# Altium project BMS_Master.PrjPcb
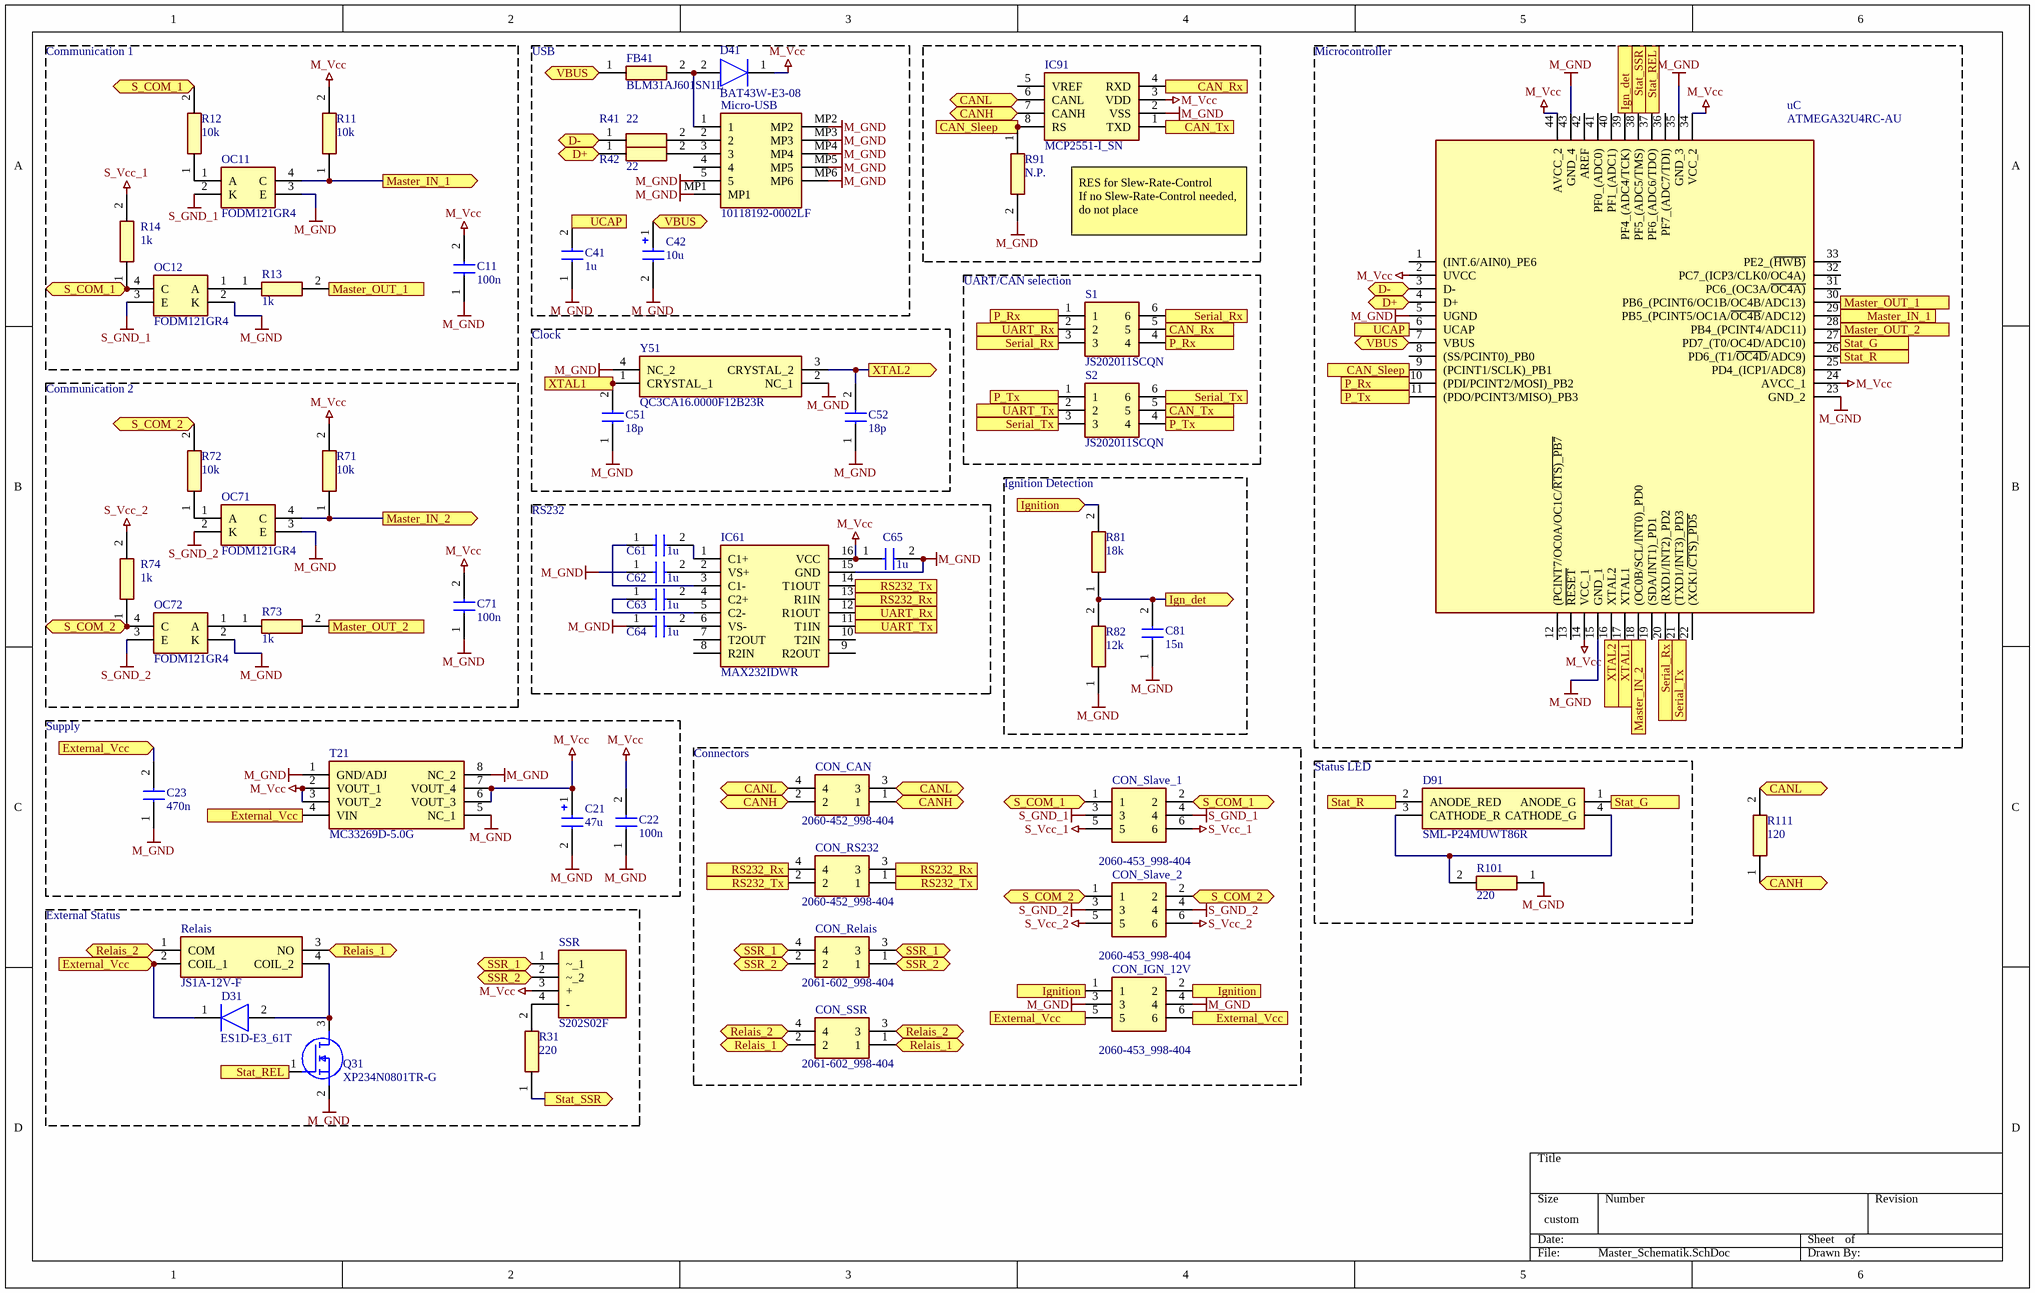
[diagram p0: Master_Schematik.SchDoc]
1 sheet, 57 parts. Net scope: flat (ports and power ports of the same name join across sheets).
Board file: Master_PCB.PcbDoc

## Sheet Master_Schematik.SchDoc: Battery Management System
size 381 x 241 mm; DrawnBy: Tristan Horvath; SheetNumber: 1; SheetTotal: 1

### Parts
C11  100n  [CAPC1608X90N]
C21  47u  [CAPAE530X550N]
C22  100n  [CAPC1608X90N]
C23  470n  [CAPC1608X90N]
C41  1u  [CAPC1608X90N]
C42  10u  [CAPAE530X550N]
C51  18p  [CAPC1608X90N]
C52  18p  [CAPC1608X90N]
C61  1u  [CAPC1608X90N]
C62  1u  [CAPC1608X90N]
C63  1u  [CAPC1608X90N]
C64  1u  [CAPC1608X90N]
C65  1u  [CAPC1608X90N]
C71  100n  [CAPC1608X90N]
C81  15n  [CAPC1608X90N]
CON_CAN  2060-452_998-404  [2060-452998-404]
CON_IGN_12V  2060-453_998-404  [2060-453998-404]
CON_Relais  2061-602_998-404  [2061-602998-404]
CON_RS232  2060-452_998-404  [2060-452998-404]
CON_Slave_1  2060-453_998-404  [2060-453998-404]
CON_Slave_2  2060-453_998-404  [2060-453998-404]
CON_SSR  2061-602_998-404  [2061-602998-404]
D31  ES1D-E3_61T  [DIOM5127X229N]
D41  BAT43W-E3-08  [SOD3716X135N]
D91  SML-P24MUWT86R  [SMLP24MUWT86R]
FB41  BLM31AJ601SN1L  [BEADC3216X130N]
IC61  MAX232IDWR  [SOIC127P1030X265-16N]
IC91  MCP2551-I_SN  [SOIC127P600X175-8N]
Micro-USB  10118192-0002LF  [101181920002LF]
OC11  FODM121GR4  [SOP254P675X240-4N]
OC12  FODM121GR4  [SOP254P675X240-4N]
OC71  FODM121GR4  [SOP254P675X240-4N]
OC72  FODM121GR4  [SOP254P675X240-4N]
Q31  XP234N0801TR-G  [SOT95P240X115-3N]
R11  10k  [RESC1608X55N]
R12  10k  [RESC1608X55N]
R13  1k  [RESC1608X55N]
R14  1k  [RESC1608X55N]
R31  220  [RESC1608X55N]
R41  22  [RESC1608X55N]
R42  22  [RESC1608X55N]
R71  10k  [RESC1608X55N]
R72  10k  [RESC1608X55N]
R73  1k  [RESC1608X55N]
R74  1k  [RESC1608X55N]
R81  18k  [RESC1608X55N]
R82  12k  [RESC1608X55N]
R91  N.P.  [RESC1608X55N]
R101  220  [RESC1608X55N]
R111  120  [RESC1608X55N]
Relais  JS1A-12V-F  [JS1A12VF]
S1  JS202011SCQN  [JS202011SCQN]
S2  JS202011SCQN  [JS202011SCQN]
SSR  S202S02F  [S202S12]
T21  MC33269D-5.0G  [SOIC127P600X175-8N]
uC  ATMEGA32U4RC-AU  [QFP80P1200X1200X120-44N]
Y51  QC3CA16.0000F12B23R  [QC3CA160000F12B23R]

### Blocks framed on the sheet
Communication 1: C11 OC11 OC12 R11-R14
USB: C41 C42 D41 FB41 Micro-USB R41 R42
Microcontroller: uC
UART/CAN selection: S1 S2
Clock: C51 C52 Y51
Communication 2: C71 OC71 OC72 R71-R74
Ignition Detection: C81 R81 R82
RS232: C61-C65 IC61
Supply: C21-C23 T21
Connectors: CON_CAN CON_IGN_12V CON_Relais CON_RS232 CON_Slave_1 CON_Slave_2 CON_SSR
Status LED: D91 R101
External Status: D31 Q31 R31 Relais SSR

### Ports
CAN_Rx (in), CAN_Rx (out), CAN_Sleep (in), CAN_Sleep (out), CAN_Tx (in), CAN_Tx (out), CANH (bidir), CANL (bidir), D+ (bidir), D- (bidir), External_Vcc (in), External_Vcc (out), Ign_det (in), Ign_det (out), Ignition (in), Ignition (out), Master_IN_1 (in), Master_IN_1 (out), Master_IN_2 (in), Master_IN_2 (out), Master_OUT_1 (in), Master_OUT_1 (out), Master_OUT_2 (in), Master_OUT_2 (out), P_Rx (in), P_Rx (out), P_Tx (in), P_Tx (out), Relais_1 (bidir), Relais_2 (bidir), RS232_Rx (in), RS232_Rx (out), RS232_Tx (in), RS232_Tx (out), S_COM_1 (bidir), S_COM_2 (bidir), Serial_Rx (in), Serial_Rx (out), Serial_Tx (in), Serial_Tx (out), SSR_1 (bidir), SSR_2 (bidir), Stat_G (in), Stat_G (out), Stat_R (in), Stat_R (out), Stat_REL (in), Stat_REL (out), Stat_SSR (in), Stat_SSR (out), UART_Rx (in), UART_Rx (out), UART_Tx (in), UART_Tx (out), UCAP (in), UCAP (out), VBUS (bidir), XTAL1 (in), XTAL1 (out), XTAL2 (in), XTAL2 (out)

### Nets
M_GND: C11.1 C21.2(-) C22.1 C23.1 C41.1 C42.2(-) C51.1 C52.1 C62.1 C64.1 C65.2 C71.1 C81.1 CON_IGN_12V.3 CON_IGN_12V.4 IC61.15(GND) IC91.2(VSS) Micro-USB.5 Micro-USB.MP1 Micro-USB.MP2 Micro-USB.MP3 Micro-USB.MP4 Micro-USB.MP5 Micro-USB.MP6 OC11.3(E) OC12.2(K) OC71.3(E) OC72.2(K) Q31.2(S) R82.1 R91.2 R101.1 T21.1(GND/ADJ) T21.5(NC_1) T21.8(NC_2) uC.5(UGND) uC.15(GND_1) uC.23(GND_2) uC.35(GND_3) uC.43(GND_4) Y51.2(NC_1) Y51.4(NC_2)
M_Vcc: C11.2 C21.1(+) C22.2 C65.1 C71.2 D41.1(K) IC61.16(VCC) IC91.3(VDD) R11.2 R71.2 SSR.3(+) T21.2(VOUT_1) T21.3(VOUT_2) T21.6(VOUT_3) T21.7(VOUT_4) uC.2(UVCC) uC.14(VCC_1) uC.24(AVCC_1) uC.34(VCC_2) uC.44(AVCC_2)
S_GND_1: CON_Slave_1.3 CON_Slave_1.4 OC11.2(K) OC12.3(E)
S_GND_2: CON_Slave_2.3 CON_Slave_2.4 OC71.2(K) OC72.3(E)
S_Vcc_1: CON_Slave_1.5 CON_Slave_1.6 R14.2
S_Vcc_2: CON_Slave_2.5 CON_Slave_2.6 R74.2
NetC23_2: C23.2 CON_IGN_12V.5 CON_IGN_12V.6 D31.1(K) Relais.2(COIL_1) T21.4(VIN) ; port External_Vcc
NetC41_2: C41.2 uC.6(UCAP) ; port UCAP
NetC42_1: C42.1(+) FB41.1 uC.7(VBUS) ; port VBUS
NetC51_2: C51.2 uC.17(XTAL1) Y51.1(CRYSTAL_1) ; port XTAL1
NetC52_2: C52.2 uC.16(XTAL2) Y51.3(CRYSTAL_2) ; port XTAL2
NetC61_1: C61.1 IC61.3(C1-)
NetC61_2: C61.2 IC61.1(C1+)
NetC62_2: C62.2 IC61.2(VS+)
NetC63_1: C63.1 IC61.5(C2-)
NetC63_2: C63.2 IC61.4(C2+)
NetC64_2: C64.2 IC61.6(VS-)
NetC81_2: C81.2 R81.1 R82.2 uC.39(PF4_(ADC4/TCK)) ; port Ign_det
NetCON_CAN_1: CON_CAN.1 CON_CAN.2 IC91.7(CANH) R111.1 ; port CANH
NetCON_CAN_3: CON_CAN.3 CON_CAN.4 IC91.6(CANL) R111.2 ; port CANL
NetCON_IGN_12V_1: CON_IGN_12V.1 CON_IGN_12V.2 R81.2 ; port Ignition
NetCON_Relais_1: CON_Relais.1 CON_Relais.2 SSR.2(~_2) ; port SSR_2
NetCON_Relais_3: CON_Relais.3 CON_Relais.4 SSR.1(~_1) ; port SSR_1
NetCON_RS232_1: CON_RS232.1 CON_RS232.2 IC61.14(T1OUT) ; port RS232_Tx
NetCON_RS232_3: CON_RS232.3 CON_RS232.4 IC61.13(R1IN) ; port RS232_Rx
NetCON_Slave_1_1: CON_Slave_1.1 CON_Slave_1.2 OC12.4(C) R12.2 R14.1 ; port S_COM_1
NetCON_Slave_2_1: CON_Slave_2.1 CON_Slave_2.2 OC72.4(C) R72.2 R74.1 ; port S_COM_2
NetCON_SSR_1: CON_SSR.1 CON_SSR.2 Relais.3(NO) ; port Relais_1
NetCON_SSR_3: CON_SSR.3 CON_SSR.4 Relais.1(COM) ; port Relais_2
NetD31_2: D31.2(A) Q31.3(D) Relais.4(COIL_2)
NetD41_2: D41.2(A) FB41.2 Micro-USB.1
NetD91_1: D91.1(ANODE_G) uC.27(PD7_(T0/OC4D/ADC10)) ; port Stat_G
NetD91_2: D91.2(ANODE_RED) uC.26(PD6_(T1/~{OC4D}/ADC9)) ; port Stat_R
NetD91_3: D91.3(CATHODE_R) D91.4(CATHODE_G) R101.2
NetIC61_11: IC61.11(T1IN) S2.2 ; port UART_Tx
NetIC61_12: IC61.12(R1OUT) S1.2 ; port UART_Rx
NetIC91_1: IC91.1(TXD) S2.5 ; port CAN_Tx
NetIC91_4: IC91.4(RXD) S1.5 ; port CAN_Rx
NetIC91_8: IC91.8(RS) R91.1 uC.9((PCINT1/SCLK)_PB1) ; port CAN_Sleep
NetMicro-USB_2: Micro-USB.2 R41.2
NetMicro-USB_3: Micro-USB.3 R42.2
NetOC11_1: OC11.1(A) R12.1
NetOC11_4: OC11.4(C) R11.1 uC.29(PB5_(PCINT5/OC1A/~{OC4B}/ADC12)) ; port Master_IN_1
NetOC12_1: OC12.1(A) R13.1
NetOC71_1: OC71.1(A) R72.1
NetOC71_4: OC71.4(C) R71.1 uC.18((OC0B/SCL/INT0)_PD0) ; port Master_IN_2
NetOC72_1: OC72.1(A) R73.1
NetQ31_1: Q31.1(G) uC.37(PF6_(ADC6/TDO)) ; port Stat_REL
NetR13_2: R13.2 uC.30(PB6_(PCINT6/OC1B/OC4B/ADC13)) ; port Master_OUT_1
NetR31_1: R31.1 uC.38(PF5_(ADC5/TMS)) ; port Stat_SSR
NetR31_2: R31.2 SSR.4(-)
NetR41_1: R41.1 uC.3(D-) ; port D-
NetR42_1: R42.1 uC.4(D+) ; port D+
NetR73_2: R73.2 uC.28(PB4_(PCINT4/ADC11)) ; port Master_OUT_2
NetS1_1: S1.1 S1.4 uC.10((PDI/PCINT2/MOSI)_PB2) ; port P_Rx
NetS1_3: S1.3 S1.6 uC.20((RXD1/INT2)_PD2) ; port Serial_Rx
NetS2_1: S2.1 S2.4 uC.11((PDO/PCINT3/MISO)_PB3) ; port P_Tx
NetS2_3: S2.3 S2.6 uC.21((TXD1/INT3)_PD3) ; port Serial_Tx

Not connected (* = marked no-connect by the designer): IC61 7(T2OUT) 8(R2IN) 9(R2OUT) 10(T2IN); IC91 5(VREF); Micro-USB 4; uC 1((INT.6/AIN0)_PE6) 8((SS/PCINT0)_PB0) 12((PCINT7/OC0A/OC1C/~{RTS)_PB7}) 13(~{RESET}) 19((SDA/INT1)_PD1) 22((XCK1/~{CTS)_PD5}) 25(PD4_(ICP1/ADC8)) 31(PC6_(OC3A/~{OC4A)}) 32(PC7_(ICP3/CLK0/OC4A)) 33(PE2_(~{HWB)}) 36(PF7_(ADC7/TDI)) 40(PF1_(ADC1)) 41(PF0_(ADC0)) 42(AREF)

### Notes on the sheet
- RES for Slew-Rate-Control
  If no Slew-Rate-Control needed, do not place

### Library data of the parts
C11 C22 C23 C41 C51 C52 C61-C65 C71 C81 = CAP
C21 C42 = ELKO
CON_CAN CON_RS232 = 2060-452_998-404: Connector; Manufacturer_Name: Wago; Manufacturer_Part_Number: 2061-602/998-404; Arrow Part Number: 2060-452/998-404; Arrow Price/Stock: https://www.arrow.com/en/products/2060-452998-404/wago-kontakttechnik-gmbh?region=nac
CON_IGN_12V CON_Slave_1 CON_Slave_2 = 2060-453_998-404: Connector; Manufacturer_Name: Wago; Manufacturer_Part_Number: 2060-452/998-404; Arrow Part Number: 2060-452/998-404; Arrow Price/Stock: https://www.arrow.com/en/products/2060-452998-404/wago-kontakttechnik-gmbh?region=nac
CON_Relais CON_SSR = 2061-602_998-404: Connector; Manufacturer_Name: Wago; Manufacturer_Part_Number: 2060-452/998-404; Arrow Part Number: 2060-452/998-404; Arrow Price/Stock: https://www.arrow.com/en/products/2060-452998-404/wago-kontakttechnik-gmbh?region=nac
D31 = ES1D-E3_61T: Diode; Manufacturer_Name: Vishay; Manufacturer_Part_Number: ES1D-E3/61T; Datasheet Link: https://componentsearchengine.com/Datasheets/2/ES1D-E3_61T.pdf; Height: 2.29mm; Mouser Part Number: 625-ES1D-E3; Mouser Price/Stock: https://www.mouser.co.uk/ProductDetail/Vishay-General-Semiconductor/ES1D-E3-61T?qs=rfh7uIuiIO0XwaKoN5aNdQ%3D%3D; Arrow Part Number: ES1D-E3/61T; Arrow Price/Stock: https://www.arrow.com/en/products/es1d-e361t/vishay
D41 = BAT43W-E3-08: Diode; Manufacturer_Name: Vishay; Datasheet Link: https://www.arrow.com/en/products/bat43w-e3-08/vishay; Height: 1.35mm; Manufacturer_Part_Number: BAT43W-E3-08; Mouser Part Number: 78-BAT43W-E3-08; Mouser Price/Stock: https://www.mouser.co.uk/ProductDetail/Vishay-Semiconductors/BAT43W-E3-08?qs=KP8Io%2FXyE5RCw3lmmA3XwQ%3D%3D; Arrow Part Number: BAT43W-E3-08; Arrow Price/Stock: https://www.arrow.com/en/products/bat43w-e3-08/vishay?region=nac
D91 = SML-P24MUWT86R: LED; Manufacturer_Name: ROHM Semiconductor; Datasheet Link: https://datasheet.datasheetarchive.com/originals/distributors/DKDS-18/357144.pdf; Height: 0.25mm; Manufacturer_Part_Number: SML-P24MUWT86R; Mouser Part Number: 755-SML-P24MUWT86R; Mouser Price/Stock: https://www.mouser.co.uk/ProductDetail/ROHM-Semiconductor/SML-P24MUWT86R?qs=SP2aZMzhwxgr8eZ6SbTI9w%3D%3D
FB41 = BLM31AJ601SN1L: Ferrite Bead; Manufacturer_Name: Murata Electronics; Datasheet Link: https://www.mouser.com/datasheet/2/281/c31e-794748.pdf; Height: 1.3mm; Manufacturer_Part_Number: BLM31AJ601SN1L; Mouser Part Number: 81-BLM31A601S; Mouser Price/Stock: https://www.mouser.co.uk/ProductDetail/Murata-Electronics/BLM31AJ601SN1L?qs=eh6oC%2F9l24qWxAxwNnqXlg%3D%3D; Arrow Part Number: BLM31AJ601SN1L; Arrow Price/Stock: https://www.arrow.com/en/products/blm31aj601sn1l/murata-manufacturing
IC61 = MAX232IDWR: Integrated Circuit; Manufacturer_Name: Texas Instruments; Datasheet Link: http://www.ti.com/lit/gpn/max232?HQS=ti-null-null-sf-df-pf-sep-wwe&DCM=yes; Height: 2.65mm; Manufacturer_Part_Number: MAX232IDWR; Mouser Part Number: 595-MAX232IDWR; Mouser Price/Stock: https://www.mouser.co.uk/ProductDetail/Texas-Instruments/MAX232IDWR?qs=NLW4NjXEBS5p6v4OAKxw4g%3D%3D; Arrow Part Number: MAX232IDWR; Arrow Price/Stock: https://www.arrow.com/en/products/max232idwr/texas-instruments?region=nac
IC91 = MCP2551-I_SN: Integrated Circuit; Manufacturer_Name: Microchip; Manufacturer_Part_Number: MCP2551-I/SN; Datasheet Link: https://datasheet.datasheetarchive.com/originals/distributors/Datasheets-34/DSA-674994.pdf; Height: 1.75mm; Mouser Part Number: 579-MCP2551-I/SN; Mouser Price/Stock: https://www.mouser.co.uk/ProductDetail/Microchip-Technology/MCP2551-I-SN?qs=9y3LFqDLL8L5zFfqqxdOHg%3D%3D; Arrow Part Number: MCP2551-I/SN; Arrow Price/Stock: https://www.arrow.com/en/products/mcp2551-isn/microchip-technology?region=nac
Micro-USB = 10118192-0002LF: Connector; Manufacturer_Name: Amphenol; Datasheet Link: https://componentsearchengine.com/Datasheets/1/10118192-0002LF.pdf; Height: 3.05mm; Manufacturer_Part_Number: 10118192-0002LF; Mouser Part Number: 649-10118192-0002LF; Mouser Price/Stock: https://www.mouser.co.uk/ProductDetail/Amphenol-FCI/10118192-0002LF?qs=KVgMXE4aH4nIkuWlMxQzog%3D%3D; Arrow Part Number: 10118192-0002LF; Arrow Price/Stock: https://www.arrow.com/en/products/10118192-0002lf/amphenol-fci?region=nac
OC11 OC12 OC71 OC72 = FODM121GR4: Integrated Circuit; Manufacturer_Name: ON Semiconductor; Datasheet Link: https://www.onsemi.com/pub/Collateral/FODM2705-D.pdf; Height: 2.4mm; Manufacturer_Part_Number: FODM121GR4; Mouser Part Number: 863-FODM121GR4; Mouser Price/Stock: https://www.mouser.co.uk/ProductDetail/onsemi/FODM121GR4?qs=byeeYqUIh0Okw76KHw6rZA%3D%3D
Q31 = XP234N0801TR-G: MOSFET (N-Channel); Manufacturer_Name: Torex; Datasheet Link: https://4donline.ihs.com/images/VipMasterIC/IC/TOSL/TOSL-S-A0008892481/TOSL-S-A0008892481-1.pdf?hkey=CECEF36DEECDED6468708AAF2E19C0C6; Height: 1.15mm; Manufacturer_Part_Number: XP234N0801TR-G; Mouser Part Number: 865-XP234N0801TR-G; Mouser Price/Stock: https://www.mouser.co.uk/ProductDetail/Torex-Semiconductor/XP234N0801TR-G?qs=BJlw7L4Cy7%252BWe%2FbHvnXcKQ%3D%3D
R11-R14 R31 R41 R42 R71-R74 R81 R82 R91 R101 R111 = RES
Relais = JS1A-12V-F: Relay or Contactor; Manufacturer_Name: Panasonic; Datasheet Link: https://componentsearchengine.com/Datasheets/2/JS1A-12V-F.pdf; Height: 16.4mm; Manufacturer_Part_Number: JS1A-12V-F; Mouser Part Number: 769-JS1A-12V-F; Mouser Price/Stock: https://www.mouser.co.uk/ProductDetail/Panasonic/JS1A-12V-F?qs=sEN%2FkO1EG6bHk8GQE7PEaQ%3D%3D; Arrow Part Number: JS1A-12V-F; Arrow Price/Stock: https://www.arrow.com/en/products/js1a-12v-f/panasonic
S1 S2 = JS202011SCQN: Switch; Manufacturer_Name: C & K COMPONENTS; Datasheet Link: http://www.ckswitches.com/media/1422/js.pdf; Height: 5.5mm; Manufacturer_Part_Number: JS202011SCQN; Mouser Part Number: 611-JS202011SCQN; Mouser Price/Stock: https://www.mouser.co.uk/ProductDetail/CK/JS202011SCQN?qs=LgMIjt8LuD95JYWxZ7NvZA%3D%3D; Arrow Part Number: JS202011SCQN; Arrow Price/Stock: https://www.arrow.com/en/products/js202011scqn/ck?region=nac
SSR = S202S02F: Relay or Contactor; Manufacturer_Name: Sharp Microelectronics; Datasheet Link: https://componentsearchengine.com/Datasheets/1/S202S02F.pdf; Height: 5mm; Manufacturer_Part_Number: S202S02F; Mouser Part Number: N/A; Mouser Price/Stock: https://www.mouser.co.uk/ProductDetail/Sharp-Microelectronics/S202S02F?qs=ijfXDZrNBl2UPSyCAmWZ0A%3D%3D
T21 = MC33269D-5.0G: Integrated Circuit; Manufacturer_Name: ON Semiconductor; Datasheet Link: http://www.onsemi.com/pub/Collateral/MC33269-D.PDF; Height: 1.75mm; Manufacturer_Part_Number: MC33269D-5.0G; Mouser Part Number: 863-MC33269D-5.0G; Mouser Price/Stock: https://www.mouser.co.uk/ProductDetail/onsemi/MC33269D-50G?qs=dFKnUM%2FquJZ0YuZ%252B66PKCA%3D%3D; Arrow Part Number: MC33269D-5.0G; Arrow Price/Stock: https://www.arrow.com/en/products/mc33269d-5.0g/on-semiconductor?region=nac
uC = ATMEGA32U4RC-AU: Integrated Circuit; Manufacturer_Name: Microchip; Datasheet Link: http://uk.rs-online.com/web/p/products/7380451; Height: 1.2mm; Manufacturer_Part_Number: ATMEGA32U4RC-AU; Mouser Part Number: 556-ATMEGA32U4RC-AU; Mouser Price/Stock: https://www.mouser.co.uk/ProductDetail/Microchip-Technology-Atmel/ATMEGA32U4RC-AU?qs=7AReRZHh%2FSt%252BRqfzkW8%2FkA%3D%3D; Arrow Part Number: ATMEGA32U4RC-AU; Arrow Price/Stock: https://www.arrow.com/en/products/atmega32u4rc-au/microchip-technology?region=nac
Y51 = QC3CA16.0000F12B23R: Crystal or Oscillator; Manufacturer_Name: Qantek; Height: 1.1mm; Manufacturer_Part_Number: QC3CA16.0000F12B23R